# EAGLE design boiler schematic (EAGLE 8.3.2)
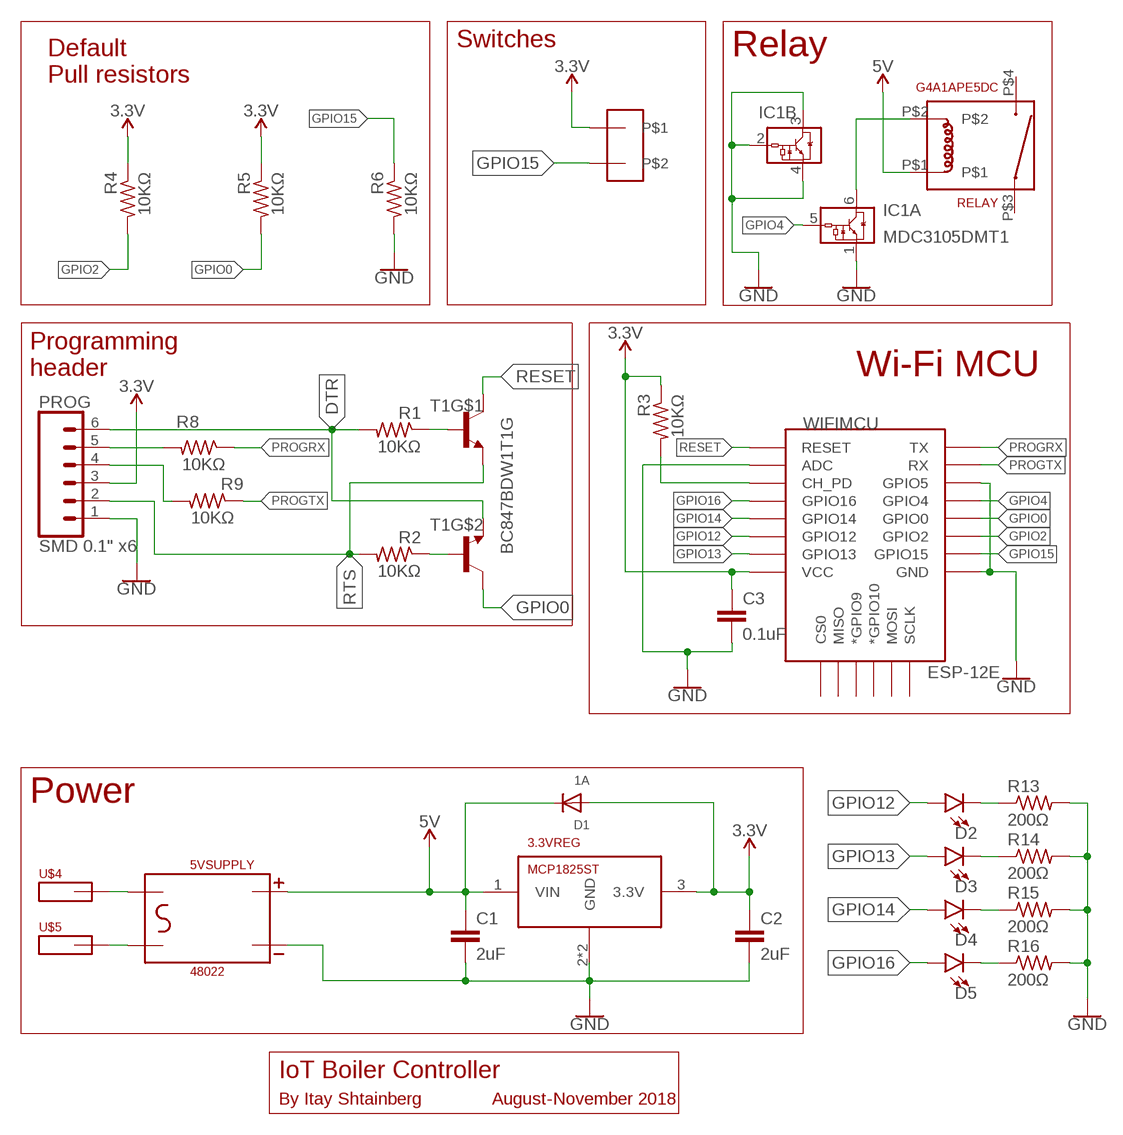
[diagram p0: schematic, sheet 1]

## Parts
3.3VREG  MCP1825ST  MCP1825ST-3302E/DB  [SOT223]
5VSUPPLY  48022  [48022]
C1  2uF  C  [C0805]
C2  2uF  C  [C0805]
C3  0.1uF  C  [C0805]
D1  1A  DIODESOD-123  [SOD-123]
D2  LED1206  [LED-1206]
D3  LED1206  [LED-1206]
D4  LED1206  [LED-1206]
D5  LED1206  [LED-1206]
IC1  MDC3105DMT1  [SC-74]
PROG  SMD 0.1" x6  CONN_06SMD-FEMALE-V2  [1X06-SMD-FEMALE]
R1  10KΩ  R-US_R0805  [R0805]
R2  10KΩ  R-US_R0805  [R0805]
R3  10KΩ  R-US_R0805  [R0805]
R4  10KΩ  R-US_R0805  [R0805]
R5  10KΩ  R-US_R0805  [R0805]
R6  10KΩ  R-US_R0805  [R0805]
R8  10KΩ  R-US_R0805  [R0805]
R9  10KΩ  R-US_R0805  [R0805]
R13  200Ω  R-US_R1206  [R1206]
R14  200Ω  R-US_R1206  [R1206]
R15  200Ω  R-US_R1206  [R1206]
R16  200Ω  R-US_R1206  [R1206]
RELAY  G4A1APE5DC  G4A-1A-E  [G4A-1A-E]
T1  BC847BDW1T1G  [SC70-6]
U$1  JST2PIN  [JST2PIN]
U$4  QUICKDISCONNECT2  [QUICKDISCONNECT2]
U$5  QUICKDISCONNECT2  [QUICKDISCONNECT2]
WIFIMCU  ESP-12E  ESP12ESMD  [ESP12E-SMD]

## Nets
3.3V: 3.3VREG.3(3.3V) C2.1 C3.1 D1.A PROG.3 R3.1 R4.1 R5.1 U$1.P$1 WIFIMCU.VCC
5V: 3.3VREG.1(VIN) 5VSUPPLY.+5V C1.1 D1.C RELAY.P$1
DTR: PROG.6 R1.2 T1.4(E)
GND: 3.3VREG.2(GND) 3.3VREG.4(GND) 5VSUPPLY.- C1.2 C2.2 C3.2 IC1.1(A:GND) IC1.2(B:VIN) IC1.3(B:VOUT) IC1.4(B:GND) PROG.1 R6.2 R13.2 R14.2 R15.2 R16.2 WIFIMCU.ADC WIFIMCU.GND WIFIMCU.GPIO5
GPIO0: R5.2 T1.3(C) WIFIMCU.GPIO0
GPIO2: R4.2 WIFIMCU.GPIO2
GPIO4: IC1.5(A:VIN) WIFIMCU.GPIO4
GPIO12: D2.A WIFIMCU.GPIO12
GPIO13: D3.A WIFIMCU.GPIO13
GPIO14: D4.A WIFIMCU.GPIO14
GPIO15: R6.1 U$1.P$2 WIFIMCU.GPIO15
GPIO16: D5.A WIFIMCU.GPIO16
N$1: 5VSUPPLY.AC1 U$4.P$1 U$4.P$2 U$4.P$3 U$4.P$4
N$2: 5VSUPPLY.AC2 U$5.P$1 U$5.P$2 U$5.P$3 U$5.P$4
N$3: D2.C R13.1
N$4: IC1.6(A:VOUT) RELAY.P$2
N$5: R1.1 T1.2(B)
N$6: PROG.4 R9.2
N$7: R2.1 T1.5(B)
N$8: PROG.5 R8.2
N$9: D3.C R14.1
N$10: D4.C R15.1
N$11: D5.C R16.1
N$12: R3.2 WIFIMCU.CH_PD
PROGRX: R8.1 WIFIMCU.TXD0(TX)
PROGTX: R9.1 WIFIMCU.RXD0(RX)
RESET: T1.6(C) WIFIMCU.RESET
RTS: PROG.2 R2.2 T1.1(E)
Unconnected: RELAY.P$3(CO) RELAY.P$4(NO) WIFIMCU.CS0 WIFIMCU.GPIO9(*GPIO9) WIFIMCU.GPIO10(*GPIO10) WIFIMCU.MISO WIFIMCU.MOSI WIFIMCU.SCLK

## Notes on the sheet
- Switches
- Relay
- Default
  Pull resistors
- Programming
  header
- Wi-Fi MCU
- Power
- IoT Boiler Controller
- By Itay Shtainberg | August-November 2018

## Library data of the parts
3.3VREG = boilerparts:MCP1825ST-3302E/DB
5VSUPPLY = boilerparts:48022
C1-C3 = eagle-ltspice:C: CAPACITOR, European symbol; SPICEMODEL: NONE; SPICEPREFIX: C
D1 = adafruit:DIODE: Diode SMADIODE - SMA Surface Mount Package 20V 1A Schottky Diode Digikey: 641-1014-6-ND DO-1N4148 - Through Hole Small Current Diode SOD-123 20V 1 A (.5mV Vf) Schottky Diode - Digikey: MBRX120TPMSCT-ND SOD-323 10V 570mA (.38mV Vf, 3ns) Schottky Diode - Digikey: ZLLS410CT-ND SOD-523 30V 30mA Schottky Diode (RB751S-40TE61) - Digikey: RB751S-40TE61CT-ND SOT23-R/W - SOT23 Package (R = Solder Paste/Reflow Ovens, W = Hand-Soldering) BAT54Film 40V 300mA - Digikey: 497-7162-1-ND
D2-D5 = SparkFun-LED:LED: LED (Generic) Standard schematic elements and footprints for 5mm, 3mm, 1206, and 0603 sized LEDs. Generic LEDs with no color specified.
IC1 = on-semiconductor:MDC3105DMT1: Integrated Relay, Inductive Load Driver Sopurce: U6 OnSemi Inductive Load Driver MDC3105-D.PDF; MPN: MDC3105DMT1G; OC_FARNELL: unknown; OC_NEWARK: 04R7836
PROG = SparkFun-Connectors:CONN_06: Multi connection point. Often used as Generic Header-pin footprint for 0.1 inch spaced/style header connections On any of the 0.1 inch spaced packages, you can populate with these: Break Away Headers - Straight <https://www.sparkfun.com/products/116> (PRT-00116) Break Away Male Headers - Right Angle <https://www.sparkfun.com/products/553> (PRT-00553) Female Headers <https://www.sparkfun.com/products/115> (PRT-00115) Break Away Headers - Machine Pin <https://www.sparkfun.com/products/117> (PRT-00117) Break Away Female Headers - Swiss Machine Pin <https://www.sparkfun.com/products/743> (PRT-00743) Arduino Stackable Header - 6 Pin <https://www.sparkfun.com/products/9280> (PRT-09280) For SCREWTERMINALS and SPRING TERMINALS visit here: Screw Terimnals on SparkFun.com <https://www.sparkfun.com/search/results?term=Screw+Terminals> (5mm/3.5mm/2.54mm spacing) This device is also useful as a general connection point to wire up your design to another part of your project. Our various solder wires solder well into these plated through hole pads. Hook-Up Wire - Assortment (Stranded, 22 AWG) <https://www.sparkfun.com/products/11375> (PRT-11375) Hook-Up Wire - Assortment (Solid Core, 22 AWG) <https://www.sparkfun.com/products/11367> (PRT-11367) View the entire wire category on our website here <https://www.sparkfun.com/categories/141>; PROD_ID: CONN-09668
R1-R6 R8 R9 = rcl:R-US_: RESISTOR, American symbol
R13-R16 = adafruit:R-US_: RESISTOR, American symbol
RELAY = boilerparts:G4A-1A-E
T1 = boilerparts:BC847BDW1T1G
U$1 = boilerparts:JST2PIN
U$4 U$5 = boilerparts:QUICKDISCONNECT2
WIFIMCU = esp8266modules:ESP12E: ESP12E Module

## Board
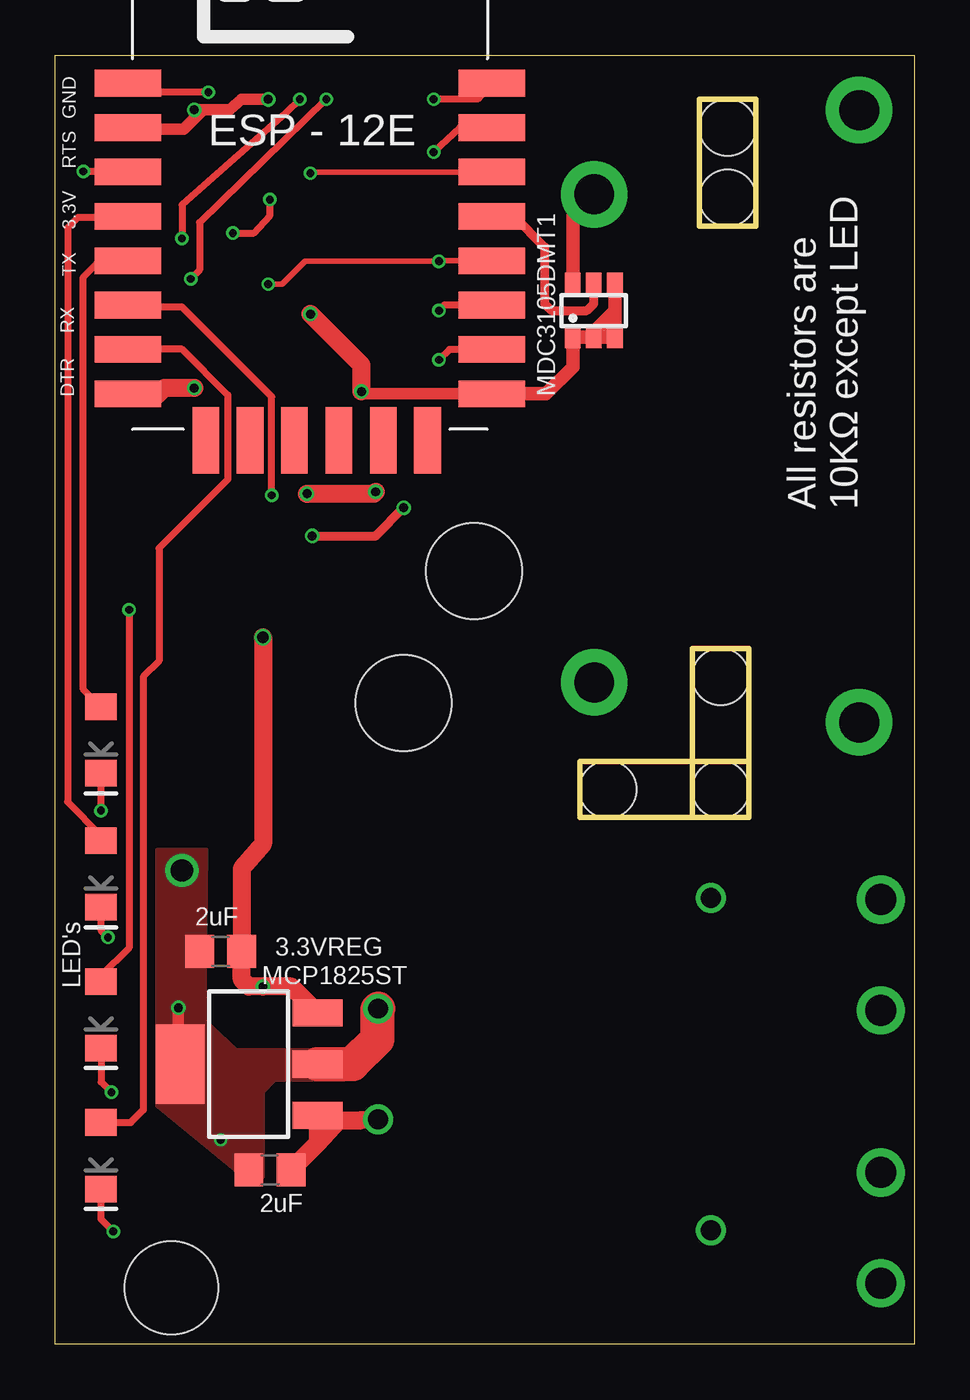
[diagram p1: board, top side]
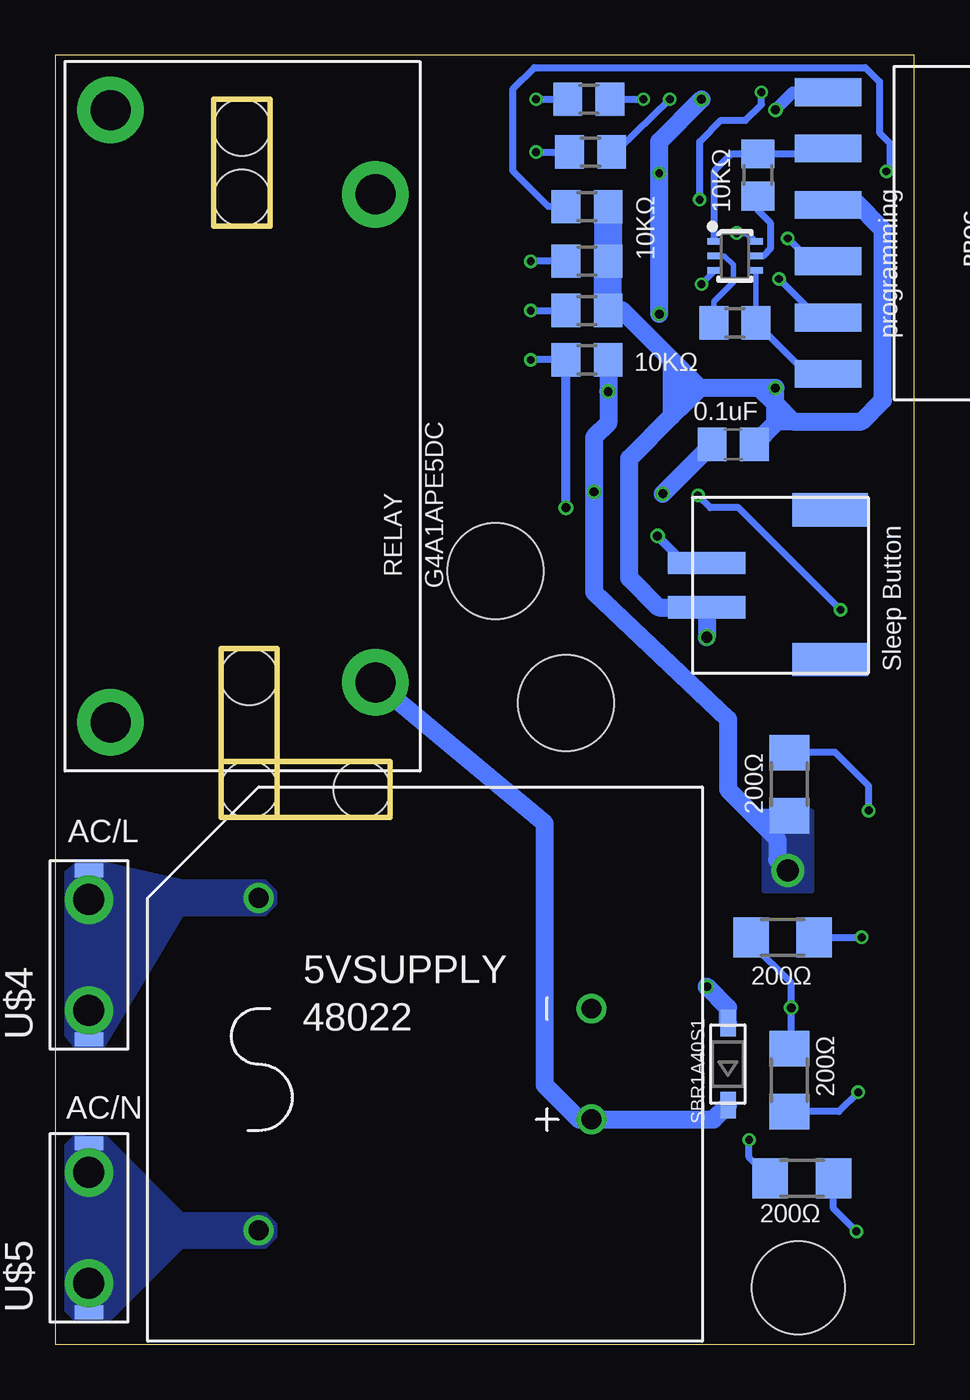
[diagram p2: board, bottom side, seen from below]

Size 38.72 x 58.09 mm. Coordinates in mm from the lower left corner, seen from the top.
Outline: 38.72,0 0,0 0,58.09 38.72,58.09 38.72,0
Copper layers (1*16): Top 0.035559375mm / dielectric 1.6mm / Bottom 0.035559375mm
Design rules "oshpark-2layer": minimum track width 6mil, minimum drill 10mil, track to track 6mil, track to pad 6mil, pad to pad 6mil, via to via 6mil, smd to smd 6mil, copper to edge 15mil, drill to drill 6mil, minimum pad ring 5mil, minimum via ring 5mil, stop-mask expansion 2.5mil, vias tented up to drill 0mil, thermal gap 10mil
Holes 4.32 mm at 15.7,28.89 18.88,34.85
Holes 2.54 mm at 29.99,25 24.91,25 29.99,30.08 30.31,54.85 30.31,51.67
Holes 4.19 mm at 5.23,2.54
Milling: 12 lines

### Footprints (pad centres in the part's own frame; a part is rotated, then mirrored left to right if it is on the bottom)
SOT223 = smd 1.219 x 2.235: 1 -2.311,-3.099; 2 0,-3.099; 3 2.311,-3.099 | smd 3.6 x 2.2: 4 0,3.099
48022 = drill 0.9: +5V 2.5,7.5; - -2.5,7.5; AC1 -7.5,-7.5; AC2 7.5,-7.5
C0805 = smd 1.3 x 1.5: 1 -0.95,0; 2 0.95,0
SOD-123 = smd 1.2 x 0.7: A 1.85,0; C -1.85,0
LED-1206 = smd 1.2 x 1.4: A -1.5,0; C 1.5,0
SC-74 = smd 0.7 x 1: 1 -0.95,-1.2; 2 0,-1.2; 3 0.95,-1.2; 4 0.95,1.2; 5 0,1.2; 6 -0.95,1.2
1X06-SMD-FEMALE = smd 1.25 x 3: 1 6.35,3.425; 2 3.81,3.425; 3 1.27,3.425; 4 -1.27,3.425; 5 -3.81,3.425; 6 -6.35,3.425
R0805 = smd 1.3 x 1.5: 1 -0.95,0; 2 0.95,0
R1206 = smd 1.6 x 1.803: 1 -1.422,0; 2 1.422,0
G4A-1A-E = drill 1.8 pad 3: P$1 -12,-5.7; P$2 10,-5.7; P$3 13.8,6.25; P$4 -13.8,6.25
SC70-6 = smd 0.3 x 0.66: 1 -0.65,-0.92; 2 0,-0.92; 3 0.65,-0.92; 4 0.65,0.92; 5 0,0.92; 6 -0.65,0.92
JST2PIN = smd 1.5 x 3.4: C 3.4,-5.55; N -3.35,-5.55 | smd 1 x 3.5: P$1 -1,0; P$2 1,0
QUICKDISCONNECT2 = drill 1.4 pad 2.184: P$1 -2.5,0; P$2 2.5,0 | smd 0.635 x 1.27: P$3 -3.81,0; P$4 3.81,0
ESP12E-SMD = smd 3 x 1.2: ADC -8.3,3.8; CH_PD -8.3,1.8; GND 8.1,-8.2; GPIO0 8.1,-2.2; GPIO2 8.1,-4.2; GPIO4 8.1,-0.2; GPIO5 8.1,1.8; GPIO12 -8.3,-4.2; GPIO13 -8.3,-6.2; GPIO14 -8.3,-2.2; GPIO15 8.1,-6.2; GPIO16 -8.3,-0.2; RESET -8.3,5.8; RXD0 8.1,3.8; TXD0 8.1,5.8; VCC -8.3,-8.2 | smd 1.2 x 3: CS0 -4.8,-10.3; GPIO9 -0.8,-10.3; GPIO10 1.2,-10.3; MISO -2.8,-10.3; MOSI 3.2,-10.3; SCLK 5.2,-10.3

### Placement (x,y rotation side)
3.3VREG  8.72,12.62 90 top
5VSUPPLY  22.05,12.62 270 bottom
C1  9.67,7.86 180 top
C2  7.45,17.7 180 top
C3  8.16,40.56 180 bottom
D1  8.4,12.62 90 bottom
D2  2.05,14.84 270 top
D3  2.05,8.49 270 top
D4  2.05,27.23 270 top
D5  2.05,21.19 270 top
IC1  24.28,46.59 0 top
PROG  0.46,50.09 90 bottom
R1  8.08,46.04 0 bottom
R2  7.05,52.7 90 bottom
R3  14.75,51.28 180 bottom
R4  14.75,46.59 180 bottom
R5  14.75,48.82 180 bottom
R6  14.75,44.37 0 bottom
R8  14.67,56.12 0 bottom
R9  14.59,53.74 0 bottom
R13  5.62,11.91 90 bottom
R14  5.07,7.46 180 bottom
R15  5.62,25.24 270 bottom
R16  5.94,18.34 180 bottom
RELAY  29.99,41.83 90 bottom
T1  8.08,49.05 270 bottom
U$1  9.35,34.21 90 bottom
U$4  37.21,17.54 90 bottom
U$5  37.21,5.24 90 bottom
WIFIMCU  11.58,51.04 0 top

### Tracks (layer width: path | path; a pad name or v marks a point on that pad's centre or on a via)
3.3V  (via drill 0.4, 0.5)
  Top 0.813: 3.3VREG.3 10.64,16.11 v9.35,16.11 8.72,16.11 8.4,16.43 C2.1 8.4,21.43 9.35,22.54 v9.35,31.86 | v6.26,43.1 4.91,43.1 4.59,42.78 3.33,42.78 WIFIMCU.VCC
  Bottom 0.813: D1.A 8.4,15.16 v9.35,16.11 | 10.94,41.83 12.85,39.93 12.85,34.53 11.53,33.21 U$1.P$1 v9.35,31.86 | 10.94,41.83 10.31,42.47 | 10.31,42.47 9.67,43.1 | 6.97,43.1 v6.26,43.1 6.26,42.39 | 6.97,43.1 9.67,43.1 | 10.31,43.74 9.67,43.1 | 10.94,44.37 13.16,46.59 R4.1 | 10.31,42.47 10.31,43.74 | 10.31,43.74 10.94,44.37 | 10.94,44.37 10.94,41.83 | 6.26,42.39 5.46,41.59 | 6.26,41.52 6.26,42.39 | 6.26,41.52 C3.1 | 5.46,41.59 6.18,41.59 6.26,41.52 | 6.97,43.1 6.26,42.39 | 5.46,41.59 2.37,41.59 1.42,42.55 1.42,50.24 2.69,51.51 3.73,51.51 PROG.3
  Bottom 1.27: R5.1 | R4.1 R5.1 | R3.1 R5.1
5V
  Top 0.508: 12.01,10.12 3.3VREG.1
  Top 0.813: 5VSUPPLY.+5V 14.39,10.12 13.72,10.08 12.77,10.08 | 12.77,10.08 11.91,10.4 3.3VREG.1 11.82,9.05 | 11.82,9.05 C1.1 | 11.82,9.05 12.77,10.08
  Bottom 0.813: RELAY.P$1 16.66,23.47 16.66,11.67 15.11,10.12 5VSUPPLY.+5V 9.05,10.12 D1.C
DTR
  Bottom 0.254: T1.4 7.13,48.37 R1.2
  Bottom 0.305: R1.2 4.67,43.58 4.05,43.58 PROG.6
GND  (via drill 0.35, 0.4, 1)
  Top 0.254: WIFIMCU.GPIO5 11.55,52.84 v11.5,52.78
  Top 0.406: 13.85,42.84 v13.8,42.94
  Top 0.508: v5.54,15.16 5.54,12.7 3.3VREG.4 | WIFIMCU.GND 13.85,42.84 | 3.35,54.77 3.64,54.77 5.78,54.77 6.3,55.28 | v9.59,56.12 8.4,56.12 7.85,55.64 6.66,55.64 | 6.3,55.28 6.66,55.64 | 6.66,55.64 v6.26,55.64 6.3,55.6 6.3,55.28
  Top 0.61: WIFIMCU.GND 22.11,42.84 23.32,44.05 IC1.1 IC1.2 | 25.23,46.59 IC1.3 24.75,45.39 | 25.23,46.59 IC1.4 | 24.75,45.39 IC1.2 | 25.23,46.59 24.75,46.12 | 24.75,46.12 24.75,45.39 | 24.75,46.12 24.28,45.64 IC1.2
  Top 0.813: v13.8,42.94 13.8,44.13 v11.5,46.43 | v11.34,38.34 14.35,38.34 v14.43,38.42 | WIFIMCU.ADC 3.57,54.84 3.64,54.77
  Top 1.524: 3.3VREG.2 13.4,12.62 14.51,13.73 14.51,15.08 5VSUPPLY.-
  Bottom 0.305: R16.2 7.36,18.09 5.54,16.27 v5.54,15.16 5.54,13.41 R13.2 | R14.2 7.45,8.42 v7.45,9.21
  Bottom 0.406: R6.2
  Bottom 0.508: PROG.1 5.46,56.44 v6.26,55.64
  Bottom 0.813: R6.2 v13.8,42.94 13.8,41.51 14.43,40.88 v14.43,38.42 14.43,33.89 8.4,28.18 8.4,25 7.13,23.73 | 7.13,23.73 5.55,23.73 | 7.13,23.73 6.18,22.78 6.18,21.83 v5.7,21.35 | v11.5,46.43 v11.5,52.78 11.5,54.21 v9.59,56.12 | C3.2 v11.34,38.34
  pour Top (isolate 0.152, no thermals): 4.59,22.3 6.81,22.3 6.73,14.61 8.16,13.26 13.01,13.26 13.01,11.91 9.91,11.91 9.35,11.35 9.35,7.54 9.04,7.22 8.4,7.22 8.08,7.86 4.59,10.72
  pour Bottom (no thermals): 6.81,24.05 4.59,24.05 4.59,20.4 6.81,20.4
GPIO0  (via drill 0.35)
  Top 0.254: WIFIMCU.GPIO0 17.31,48.84 v17.29,48.82 11.26,48.82 10.23,47.78 v9.59,47.78
  Bottom 0.254: v9.59,47.78 9,48.37 T1.3
  Bottom 0.305: R5.2 v17.29,48.82
GPIO2  (via drill 0.35)
  Top 0.305: WIFIMCU.GPIO2 17.54,46.84 v17.29,46.59
  Bottom 0.305: v17.29,46.59 R4.2
GPIO4
  Top 0.406: WIFIMCU.GPIO4 20.67,50.84 22.05,49.45 22.05,46.91 22.37,46.59 23.96,46.59 24.28,46.91 IC1.5
GPIO12  (via drill 0.35)
  Top 0.305: D2.A 2.05,16.59 3.32,17.86 v3.32,33.1 | v9.75,38.26 9.75,42.7 5.7,46.75 3.36,46.75 WIFIMCU.GPIO12
  Bottom 0.305: v3.32,33.1 7.93,37.7 9.19,37.7 v9.75,38.26
GPIO13
  Top 0.305: D3.A 3.39,9.99 3.96,10.56 3.96,30.08 4.67,30.8 4.67,35.88 7.77,38.97 7.77,42.78 5.7,44.85 WIFIMCU.GPIO13
GPIO14
  Top 0.305: WIFIMCU.GPIO14 3.22,48.9 2.05,48.9 1.26,48.1 1.26,29.52 D4.A
GPIO15  (via drill 0.35, 0.4)
  Top 0.305: WIFIMCU.GPIO15 17.76,44.84 v17.29,44.37
  Top 0.406: v11.58,36.43 14.43,36.43 v15.7,37.7
  Bottom 0.305: R6.1 v17.29,44.37
  Bottom 0.406: U$1.P$2 10.35,35.21 v11.58,36.43 | v15.7,37.7 R6.1
GPIO16
  Top 0.305: D5.A 2.05,22.94 0.54,24.45 0.54,50.32 1.02,50.8 3.24,50.8 WIFIMCU.GPIO16
N$1
  pour Bottom (no thermals): 33.01,20.88 29.28,20.88 28.8,20.4 28.8,19.84 29.28,19.37 33.01,19.37 36.58,13.41 37.85,13.41 38.25,13.89 38.25,21.27 37.77,21.67 36.5,21.67
N$2
  pour Bottom (no thermals): 33.01,5.87 29.28,5.87 28.8,5.4 28.8,4.84 29.28,4.37 33.01,4.37 36.34,1.03 37.85,1.11 38.25,1.51 38.25,8.97 37.85,9.37 36.42,9.29
N$3  (via drill 0.35)
  Top 0.305: 2.06,13.34 2.06,11.82 v2.53,11.35
  Top 0.508: D2.C 2.06,13.34
  Bottom 0.305: v2.53,11.35 3.39,10.48 R13.1
N$4
  Top 0.61: IC1.6 23.33,50.87 RELAY.P$2
N$5
  Bottom 0.254: T1.2 8.56,49.05 8.16,48.66 8.16,47.86 9.04,46.99 R1.1
N$6  (via drill 0.35)
  Top 0.305: v11.02,56.12 10.39,55.48 5.7,51.36 v5.7,49.85
  Bottom 0.305: R9.2 13.32,53.9 v11.02,56.12 | v5.7,49.85 4.35,48.5 4.21,48.5 PROG.4
N$7
  Bottom 0.305: R2.1 7.05,51.12 6.5,50.56 6.5,49.37 6.81,49.05 T1.5
N$8  (via drill 0.35)
  Top 0.305: v12.21,56.12 6.5,50.56 6.5,48.42 v6.1,48.02
  Bottom 0.305: R8.2 v12.21,56.12 | v6.1,48.02 4.43,46.35 3.97,46.35 PROG.5
N$9  (via drill 0.35)
  Top 0.305: D3.C 2.05,5.64 v2.61,5.08
  Bottom 0.305: v2.61,5.08 3.65,6.12 R14.1
N$10  (via drill 0.35)
  Top 0.305: D4.C v2.05,24.05
  Bottom 0.305: v2.05,24.05 2.05,25.16 3.56,26.67 5.62,26.67 R15.1
N$11  (via drill 0.35)
  Top 0.305: D5.C 2.05,18.65 v2.37,18.34
  Bottom 0.305: R16.1 v2.37,18.34
N$12  (via drill 0.35)
  Top 0.305: v1.26,52.86 3.25,52.86 WIFIMCU.CH_PD
  Bottom 0.305: R3.2 16.5,51.28 18.09,52.86 18.09,56.59 17.13,57.55 2.21,57.55 1.57,56.91 1.57,54.61 1.1,54.13 1.1,53.02 v1.26,52.86
PROGRX  (via drill 0.35)
  Top 0.305: WIFIMCU.TXD0 19.04,56.12 v17.05,56.12
  Bottom 0.305: v17.05,56.12 R8.1
PROGTX  (via drill 0.35)
  Top 0.305: WIFIMCU.RXD0 18.23,54.84 v17.05,53.74
  Bottom 0.305: v17.05,53.74 R9.1
RESET  (via drill 0.35)
  Top 0.305: v6.89,56.44 3.68,56.44 WIFIMCU.RESET | v8,50.09 8.96,50.09 9.67,50.88 v9.67,51.59
  Bottom 0.305: v6.89,56.44 6.89,55.88 7.61,55.17 8.72,55.17 9.67,54.21 v9.67,51.59 | T1.6 7.55,50.09 v8,50.09
RTS
  Bottom 0.305: T1.1 9,52.9 8.24,53.66 R2.2 4.13,53.66 PROG.2

### Text on the board
tNames: GND | RTS | 3.3V | TX | RX | DTR | All resistors are / 10KΩ except LED | LED's
bNames: 10KΩ | programming | 10KΩ | 10KΩ | G4A1APE5DC | Sleep Button | AC/L | SBR1A40S1 | AC/N